# Altium project 显示板.PrjPcb
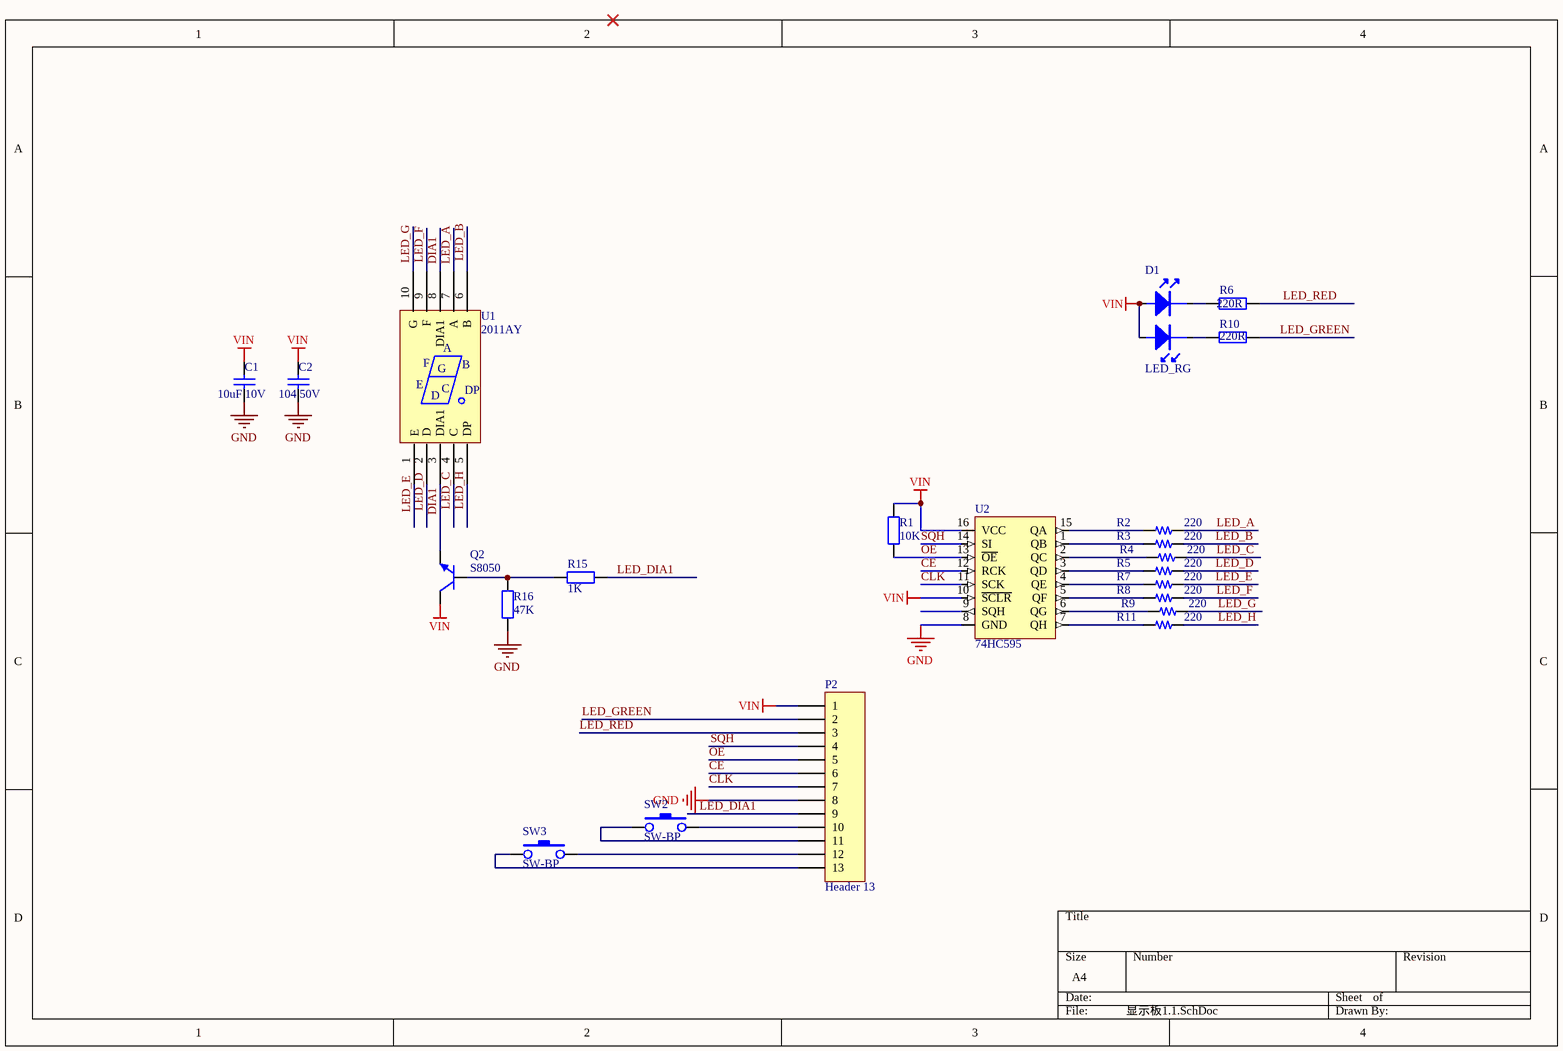
[diagram p0: 显示板1.1.SchDoc]
1 sheet, 22 parts. Net scope: global (net labels, ports and power ports of the same name join across sheets).
Board file: 显示板V1.0_ZM_20210706.PcbDoc

## Sheet 显示板1.1.SchDoc
size A4

### Parts
C1  10uF 10V  [SMD-0603C]
C2  104 50V  [SMD-0603C]
D1  LED_RG
P2  Header 13  [13×1.25mmSMT]
Q2  S8050  [SOT-23]
R1  10K  [SMD-0603]
R2  220  [0603R]
R3  220  [0603R]
R4  220  [0603R]
R5  220  [0603R]
R6  220R  [SMD-0603]
R7  220  [0603R]
R8  220  [0603R]
R9  220  [0603R]
R10  220R  [SMD-0603]
R11  220  [0603R]
R15  1K  [SMD-0603]
R16  47K  [SMD-0603]
SW2  SW-BP  [KEY_4X4]
SW3  SW-BP  [KEY_4X4]
U1  2011AY  [2011AY]
U2  74HC595  [SSOP-16]

### Nets
GND: C1.1 C2.1 P2.8 R16.2 U2.8(GND)
VIN: C1.2 C2.2 D1.2 D1.4 P2.1 Q2.3(C) R1.2 U2.10(~{SCLR}) U2.16(VCC)
CE: P2.6 U2.12(RCK)
CLK: P2.7 U2.11(SCK)
DIA1: Q2.2(E) U1.3(DIA1) U1.8(DIA1)
LED_A: R2.2 U1.7(A)
LED_B: R3.2 U1.6(B)
LED_C: R4.2 U1.4(C)
LED_D: R5.2 U1.2(D)
LED_DIA1: P2.9 R15.1
LED_E: R7.2 U1.1(E)
LED_F: R8.2 U1.9(F)
LED_G: R9.2 U1.10(G)
LED_GREEN: P2.2 R10.2
LED_H: R11.2 U1.5(DP)
LED_RED: P2.3 R6.2
OE: P2.5 R1.1 U2.13(~{OE})
SQH: P2.4 U2.14(SI)
NetD1_1: D1.1 R10.1
NetD1_3: D1.3 R6.1
NetP2_10: P2.10 SW2.2
NetP2_11: P2.11 SW2.1
NetP2_12: P2.12 SW3.2
NetP2_13: P2.13 SW3.1
NetQ2_1: Q2.1(B) R15.2 R16.1
NetR2_1: R2.1 U2.15(QA)
NetR3_1: R3.1 U2.1(QB)
NetR4_1: R4.1 U2.2(QC)
NetR5_1: R5.1 U2.3(QD)
NetR7_1: R7.1 U2.4(QE)
NetR8_1: R8.1 U2.5(QF)
NetR9_1: R9.1 U2.6(QG)
NetR11_1: R11.1 U2.7(QH)

Not connected (* = marked no-connect by the designer): U2 9(SQH)

### Library data of the parts
C1 C2 = CAP4: 贴片电容 10%
P2 = Header 13: Header, 13-Pin; LatestRevisionDate: 17-Jul-2002; LatestRevisionNote: Re-released for DXP Platform.; Publisher: Altium Limited
Q2 = NPN-1: NPN
R1 R6 R10 R15 R16 = RES0: 贴片电阻 5%
R2-R5 R7-R9 R11 = R
SW2 SW3 = SW-BP: 3*6*3.5侧贴按键(编带)
U2 = 74HC595: 逻辑IC